# EAGLE design stepper_motor_driver_schem (EAGLE 9.6.2)
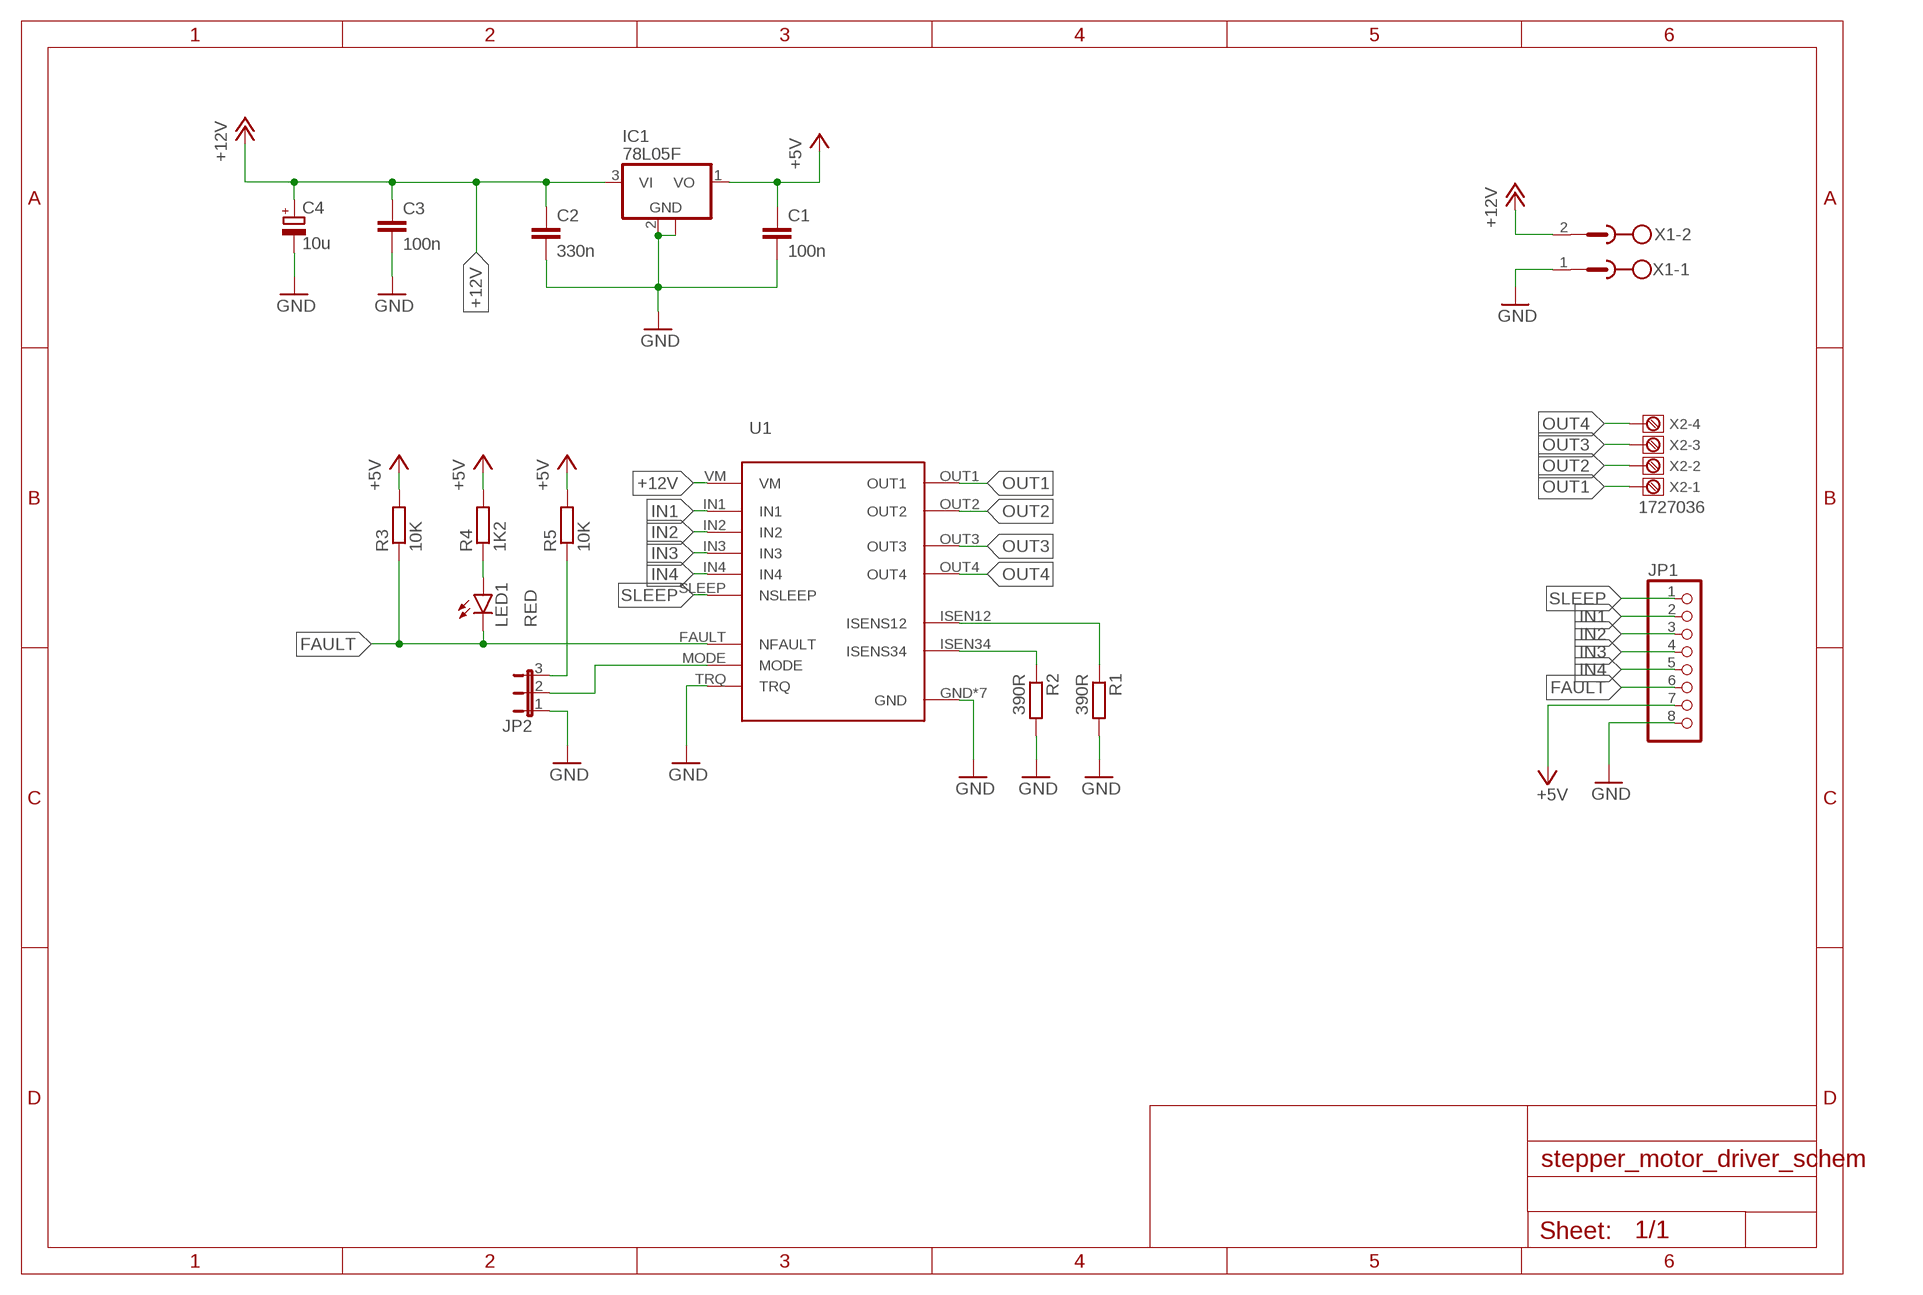
[diagram p0: schematic, sheet 1]

## Parts
C1  100n  C-EUC0402  [C0402]
C2  330n  C-EUC0402  [C0402]
C3  100n  C-EUC0402  [C0402]
C4  10u  CPOL-EUE2-5  [E2-5]
IC1  78L05F  [SOT89]
JP1  PINHD-1X8  [1X08]
JP2  JP2E  [JP2]
LED1  RED  LEDCHIP-LED0603  [CHIP-LED0603]
R1  390R  R-EU_R1206  [R1206]
R2  390R  R-EU_R1206  [R1206]
R3  10K  R-EU_R0603  [R0603]
R4  1K2  R-EU_R0603  [R0603]
R5  10K  R-EU_R0603  [R0603]
U1  DRV8847RTER  [DRV8847RTER]
X1  MSTBV2  [MSTBV2]
X2  1727036  [1727036]

## Nets
+5V: C1.1 IC1.1(VO) JP1.7 R3.2 R4.2 R5.2
+12V: C2.1 C3.1 C4.+ IC1.3(VI) U1.VM X1.2
FAULT: JP1.6 LED1.C R3.1 U1.FAULT(NFAULT)
GND: C1.2 C2.2 C3.2 C4.- IC1.2(GND) IC1.2@1(GND) JP1.8 JP2.1 R1.2 R2.2 U1.GND U1.T1(GND) U1.T2(GND) U1.T3(GND) U1.T4(GND) U1.T5(GND) U1.THERMAL_PAD(GND) U1.TRQ X1.1
IN1: JP1.2 U1.IN1
IN2: JP1.3 U1.IN2
IN3: JP1.4 U1.IN3
IN4: JP1.5 U1.IN4
N$1: R2.1 U1.ISEN34(ISENS34)
N$2: R1.1 U1.ISEN12(ISENS12)
N$3: LED1.A R4.1
N$4: JP2.2 U1.MODE
N$5: JP2.3 R5.1
OUT1: U1.OUT1 X2.1
OUT2: U1.OUT2 X2.2
OUT3: U1.OUT3 X2.3
OUT4: U1.OUT4 X2.4
SLEEP: JP1.1 U1.SLEEP(NSLEEP)

## Library data of the parts
C1-C3 = rcl:C-EU: CAPACITOR, European symbol; SPICEPREFIX: C
C4 = rcl:CPOL-EU: POLARIZED CAPACITOR, European symbol; SPICEPREFIX: C
IC1 = linear:78L*: POSITOIV-VOLTAGE REGULATORS Output up to 100 mA Source: Datasheet <http://focus.ti.com/lit/ds/symlink/ua78l05.pdf>
JP1 = pinhead:PINHD-1X8: PIN HEADER
JP2 = jumper:JP2E: JUMPER
LED1 = led:LED: LED OSRAM: - CHIPLED LG R971, LG N971, LY N971, LG Q971, LY Q971, LO R971, LY R971 LH N974, LH R974 LS Q976, LO Q976, LY Q976 LO Q996 - Hyper CHIPLED LW Q18S LB Q993, LB Q99A, LB R99A - SideLED LS A670, LO A670, LY A670, LG A670, LP A670 LB A673, LV A673, LT A673, LW A673 LH A674 LY A675 LS A676, LA A676, LO A676, LY A676, LW A676 LS A679, LY A679, LG A679 - Hyper Micro SIDELED® LS Y876, LA Y876, LO Y876, LY Y876 LT Y87S - SmartLED LW L88C, LW L88S LB L89C, LB L89S, LG L890 LS L89K, LO L89K, LY L89K LS L896, LA L896, LO L896, LY L896 - TOPLED LS T670, LO T670, LY T670, LG T670, LP T670 LSG T670, LSP T670, LSY T670, LOP T670, LYG T670 LG T671, LOG T671, LSG T671 LB T673, LV T673, LT T673, LW T673 LH T674 LS T676, LA T676, LO T676, LY T676, LB T676, LH T676, LSB T676, LW T676 LB T67C, LV T67C, LT T67C, LS T67K, LO T67K, LY T67K, LW E67C LS E67B, LA E67B, LO E67B, LY E67B, LB E67C, LV E67C, LT E67C LW T67C LS T679, LY T679, LG T679 LS T770, LO T770, LY T770, LG T770, LP T770 LB T773, LV T773, LT T773, LW T773 LH T774 LS E675, LA E675, LY E675, LS T675 LS T776, LA T776, LO T776, LY T776, LB T776 LHGB T686 LT T68C, LB T68C - Hyper Mini TOPLED® LB M676 - Mini TOPLED Santana® LG M470 LS M47K, LO M47K, LY M47K Source: http://www.osram.convergy.de LUXEON: - LUMILED® LXK2-PW12-R00, LXK2-PW12-S00, LXK2-PW14-U00, LXK2-PW14-V00 LXK2-PM12-R00, LXK2-PM12-S00, LXK2-PM14-U00 LXK2-PE12-Q00, LXK2-PE12-R00, LXK2-PE12-S00, LXK2-PE14-T00, LXK2-PE14-U00 LXK2-PB12-K00, LXK2-PB12-L00, LXK2-PB12-M00, LXK2-PB14-N00, LXK2-PB14-P00, LXK2-PB14-Q00 LXK2-PR12-L00, LXK2-PR12-M00, LXK2-PR14-Q00, LXK2-PR14-R00 LXK2-PD12-Q00, LXK2-PD12-R00, LXK2-PD12-S00 LXK2-PH12-R00, LXK2-PH12-S00 LXK2-PL12-P00, LXK2-PL12-Q00, LXK2-PL12-R00 Source: www.luxeon.com KINGBRIGHT: KA-3528ASYC Source: www.kingbright.com
R1-R5 = rcl:R-EU_: RESISTOR, European symbol; SPICEPREFIX: R
U1 = DRV8847:DRV8847RTER
X1 = con-phoenix-500:MSTBV2: PHOENIX; OC_FARNELL: unknown; OC_NEWARK: unknown
X2 = con-phoenix-3.81:1727036: MKDS 1/4-3,81 Source: http://eshop.phoenixcontact.de; MF: FARNELL; MPN: 1727036; OC_FARNELL: 3704592; OC_NEWARK: 71C4114

## Board
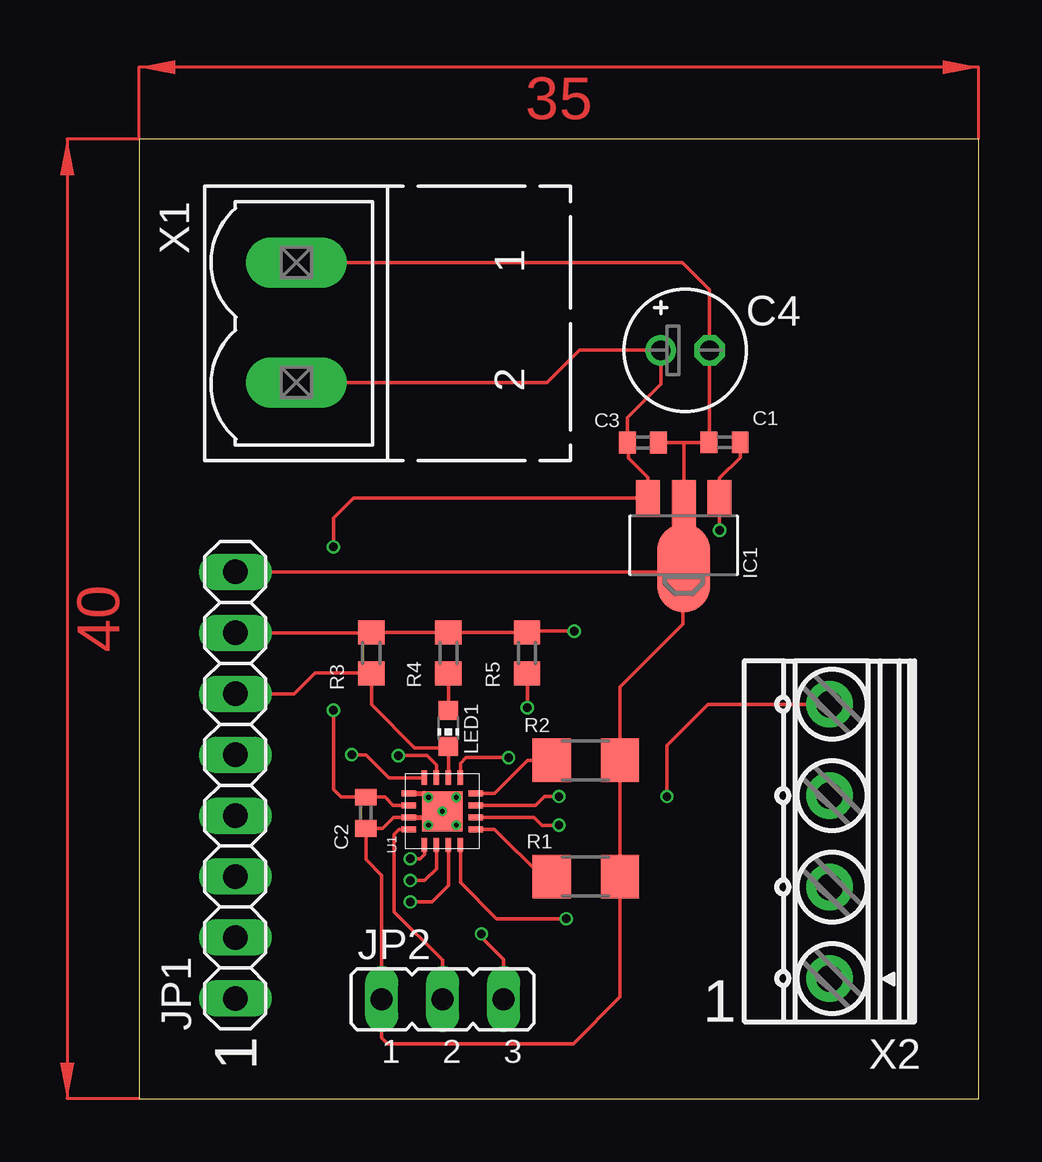
[diagram p1: board, top side]
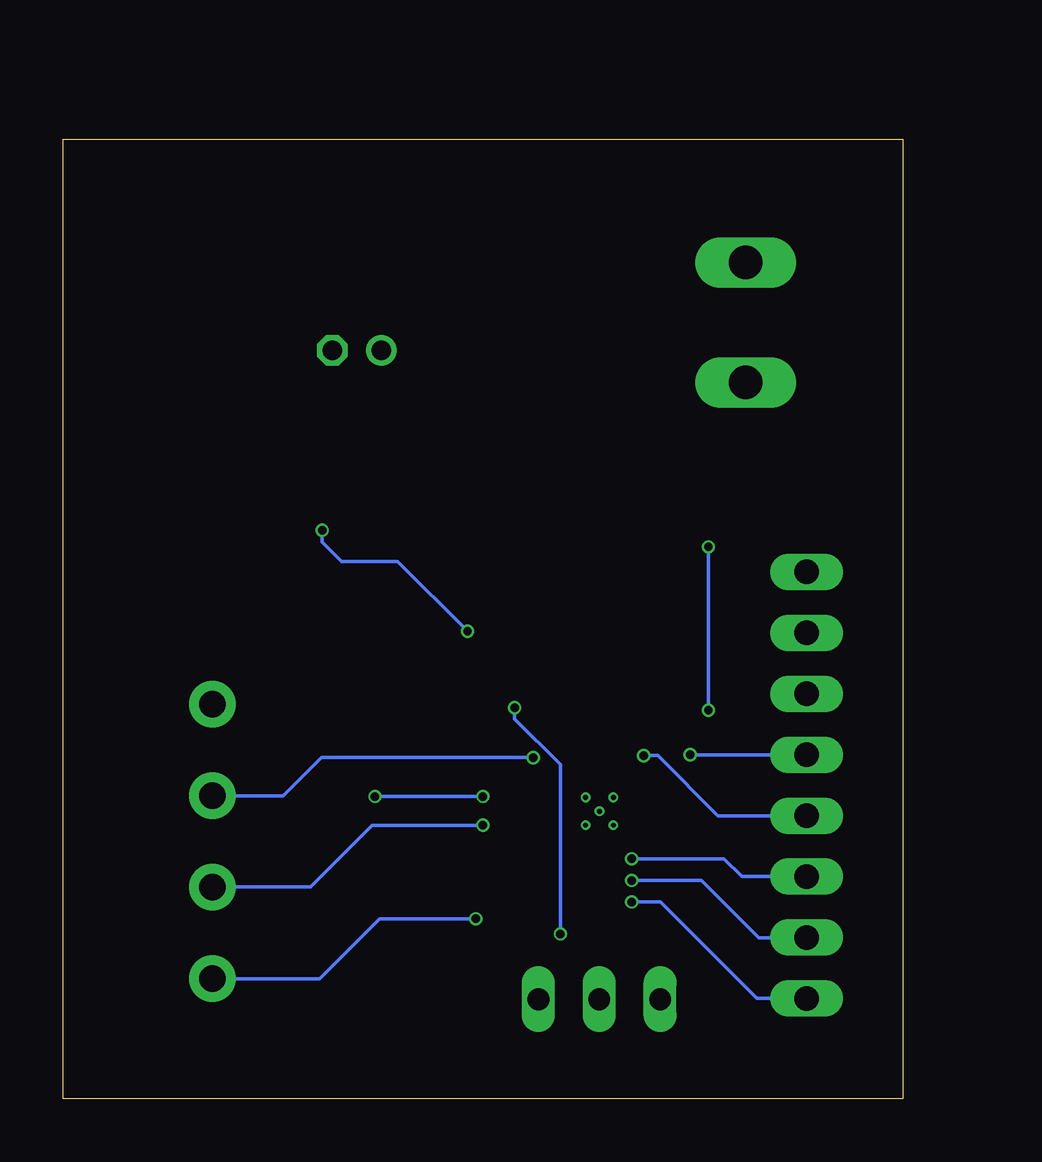
[diagram p2: board, bottom side, seen from below]

Size 35 x 40 mm. Coordinates in mm from the lower left corner, seen from the top.
Outline: 0,0 35,0 35,40 0,40 0,0
Copper layers (1*16): Top 0.035mm / dielectric 1.5mm / Bottom 0.035mm
Design rules "default *": minimum track width 0.1mm, minimum drill 0.1mm, track to track 0.1mm, track to pad 0.1mm, pad to pad 0.1mm, via to via 0.1mm, smd to smd 0.1mm, copper to edge 0.2mm, drill to drill 6mil, minimum pad ring 0.1mm, minimum via ring 0.1mm, stop-mask expansion 4mil, vias tented up to drill 0mil, thermal gap 10mil

### Footprints (pad centres in the part's own frame; a part is rotated, then mirrored left to right if it is on the bottom)
C0402 = smd 0.7 x 0.9: 1 -0.65,0; 2 0.65,0
E2-5 = drill 0.813 pad 1.27: + -1.016,0 | drill 0.813 pad 1.27 octagon: - 1.016,0
SOT89 = smd 1 x 1.5: 1 -1.499,-1.981; 3 1.499,-1.981 | smd 1 x 2: 2 0,-1.727 | smd 2.2 x 3.7: 2@1 0,0.94
1X08 = drill 1.016 long: 1 -8.89,0; 2 -6.35,0; 3 -3.81,0; 4 -1.27,0; 5 1.27,0; 6 3.81,0; 7 6.35,0; 8 8.89,0
JP2 = drill 0.914 long: 1 -2.54,0; 2 0,0; 3 2.54,0
CHIP-LED0603 = smd 0.8 x 0.8: A 0,-0.75; C 0,0.75
R1206 = smd 1.6 x 1.803: 1 -1.422,0; 2 1.422,0
R0603 = smd 1 x 1.1: 1 -0.85,0; 2 0.85,0
DRV8847RTER = smd 0.6 x 0.24: FAULT 2.15,1.15; IN1 -0.65,1.65; IN2 -0.65,2.15; IN3 2.15,1.65; IN4 2.15,2.15; OUT1 -0.65,0.65; OUT3 2.15,0.65; SLEEP -0.65,1.15 | smd 0.24 x 0.6: GND 0.5,2.8; ISEN12 0,0; ISEN34 1.5,0; MODE 0,2.8; OUT2 0.5,0; OUT4 1,0; TRQ 1.5,2.8; VM 1,2.8 | drill 0.2 pad 0.305: T1 0.17,1.98; T2 1.33,1.98; T3 0.17,0.82; T4 1.33,0.82; T5 0.75,1.4 | smd 1.68 x 1.68: THERMAL_PAD 0.75,1.4
MSTBV2 = drill 1.397 long: 1 -2.5,0; 2 2.5,0
1727036 = drill 1.1 pad 1.93: 1 -5.715,0; 2 -1.905,0; 3 1.905,0; 4 5.715,0

### Placement (x,y rotation side)
C1  24.4,27.36 180 top
C2  9.46,11.93 270 top
C3  21,27.35 0 top
C4  22.76,31.2 0 top
IC1  22.7,23.06 180 top
JP1  4.01,13.07 90 top
JP2  12.65,4.15 0 top
LED1  12.89,15.44 180 top
R1  18.62,9.26 0 top
R2  18.62,14.11 0 top
R3  9.68,18.58 90 top
R4  12.89,18.58 90 top
R5  16.17,18.58 90 top
U1  14.04,11.23 90 top
X1  6.55,32.36 270 top
X2  28.78,10.73 90 top

### Tracks (layer width: path | path; a pad name or v marks a point on that pad's centre or on a via)
+5V  (via drill 0.35)
  Top 0.15: C1.1 25.06,26.73 24.2,25.87 IC1.1 v24.2,23.7 | JP1.7 R3.2 R4.2 R5.2 16.24,19.5 v18.13,19.5 v18.14,19.49
  Bottom 0.15: v18.14,19.49 21.05,22.4 23.4,22.4 24.2,23.2 v24.2,23.7
+12V  (via drill 0.35)
  Top 0.15: U1.VM 10.59,12.23 10.24,12.57 C2.1 8.43,12.57 8.1,12.9 v8.1,16.2 | X1.2 17.01,29.86 18.35,31.2 C4.+ 21.74,29.78 20.35,28.39 C3.1 20.4,27.3 20.4,26.7 21.2,25.9 IC1.3 8.94,25.04 8.1,24.2 v8.1,23
  Bottom 0.15: v8.1,23 v8.1,16.2
FAULT
  Top 0.15: LED1.C 12.89,14.63 | 12.89,14.63 U1.FAULT | 12.89,14.63 11.49,14.63 9.68,16.44 R3.1 7.33,17.74 6.47,16.88 JP1.6
GND
  Top 0.15: IC1.2@1 22.7,22 | 22.7,22 22.7,21.96 JP1.8 | 22.7,21.95 22.66,19.79 20.04,17.17 R2.2 R1.2 20.04,4.24 18.1,2.3 10.36,2.3 10.11,2.55 JP2.1 10.11,9.32 9.45,9.98 9.45,11.24 9.48,11.28 | C2.2 9.48,11.28 | 9.48,11.28 10.14,11.28 10.6,11.73 U1.GND | C3.2 22.7,27.35 | 22.7,27.35 C1.2 23.78,27.39 C4.- 23.78,33.73 22.65,34.86 X1.1 | 22.7,27.35 IC1.2 22.7,22
  Top 0.2: U1.TRQ 11.89,12.73 U1.T2 U1.T5 | U1.GND 12.39,11.73 U1.T5 | U1.T5 U1.T3 | U1.T5 U1.T1 | U1.T5 U1.T4
IN1  (via drill 0.35)
  Top 0.15: U1.IN1 12.39,9.59 11.9,9.1 v11.3,9.1
  Bottom 0.15: v11.3,9.1 8.4,9.1 6,6.7 4.03,6.7 JP1.2
IN2  (via drill 0.35)
  Top 0.15: U1.IN2 11.89,10.19 11.7,10 v11.3,10
  Bottom 0.15: JP1.3 6.71,9.26 7.45,10 v11.3,10
IN3  (via drill 0.35)
  Top 0.15: U1.IN3 12.39,13.91 12,14.3 v10.8,14.3
  Bottom 0.15: v10.8,14.3 10.2,14.3 7.7,11.8 JP1.4
IN4  (via drill 0.35)
  Top 0.15: U1.IN4 10.42,13.38 9.46,14.34 v8.86,14.34
  Bottom 0.15: v8.86,14.34 JP1.5
N$1
  Top 0.15: U1.ISEN34 14.81,12.73 16.19,14.11 R2.1
N$2
  Top 0.15: R1.1 16.79,9.26 14.82,11.23 U1.ISEN12
N$3
  Top 0.15: R4.1 LED1.A
N$4
  Top 0.15: JP2.2 12.65,5.78 10.63,7.8 10.63,11.02 10.84,11.23 U1.MODE
N$5  (via drill 0.35)
  Top 0.15: JP2.3 15.19,5.81 14.27,6.73 v14.27,6.87 | v16.18,16.3 R5.1
  Bottom 0.15: v16.18,16.3 16.18,15.84 14.27,13.93 v14.27,6.87
OUT1  (via drill 0.35)
  Top 0.15: U1.OUT1 13.39,9.01 14.9,7.5 v17.8,7.5
  Bottom 0.15: v17.8,7.5 21.8,7.5 24.3,5 28.77,5 X2.1
OUT2  (via drill 0.35)
  Top 0.15: U1.OUT2 16.47,11.73 16.8,11.4 v17.5,11.4
  Bottom 0.15: v17.5,11.4 22.11,11.4 24.68,8.82 X2.2
OUT3  (via drill 0.35)
  Top 0.15: U1.OUT3 13.39,13.98 13.63,14.22 v15.4,14.22
  Bottom 0.15: v15.4,14.22 24.23,14.22 25.82,12.63 X2.3
OUT4  (via drill 0.35)
  Top 0.15: U1.OUT4 16.53,12.23 16.9,12.6 v17.5,12.6 | v22,12.6 22,14.73 23.71,16.45 X2.4
  Bottom 0.15: v17.5,12.6 v22,12.6
SLEEP  (via drill 0.35)
  Top 0.15: U1.SLEEP 12.89,8.89 12.2,8.2 v11.3,8.2
  Bottom 0.15: v11.3,8.2 10.1,8.2 6.08,4.18 JP1.1
(copper drawn outside any net)
  shapes: Top area x2

### Text on the board
tPlace: 1 | 1